# EAGLE schematic servo_controller (EAGLE 6.4)
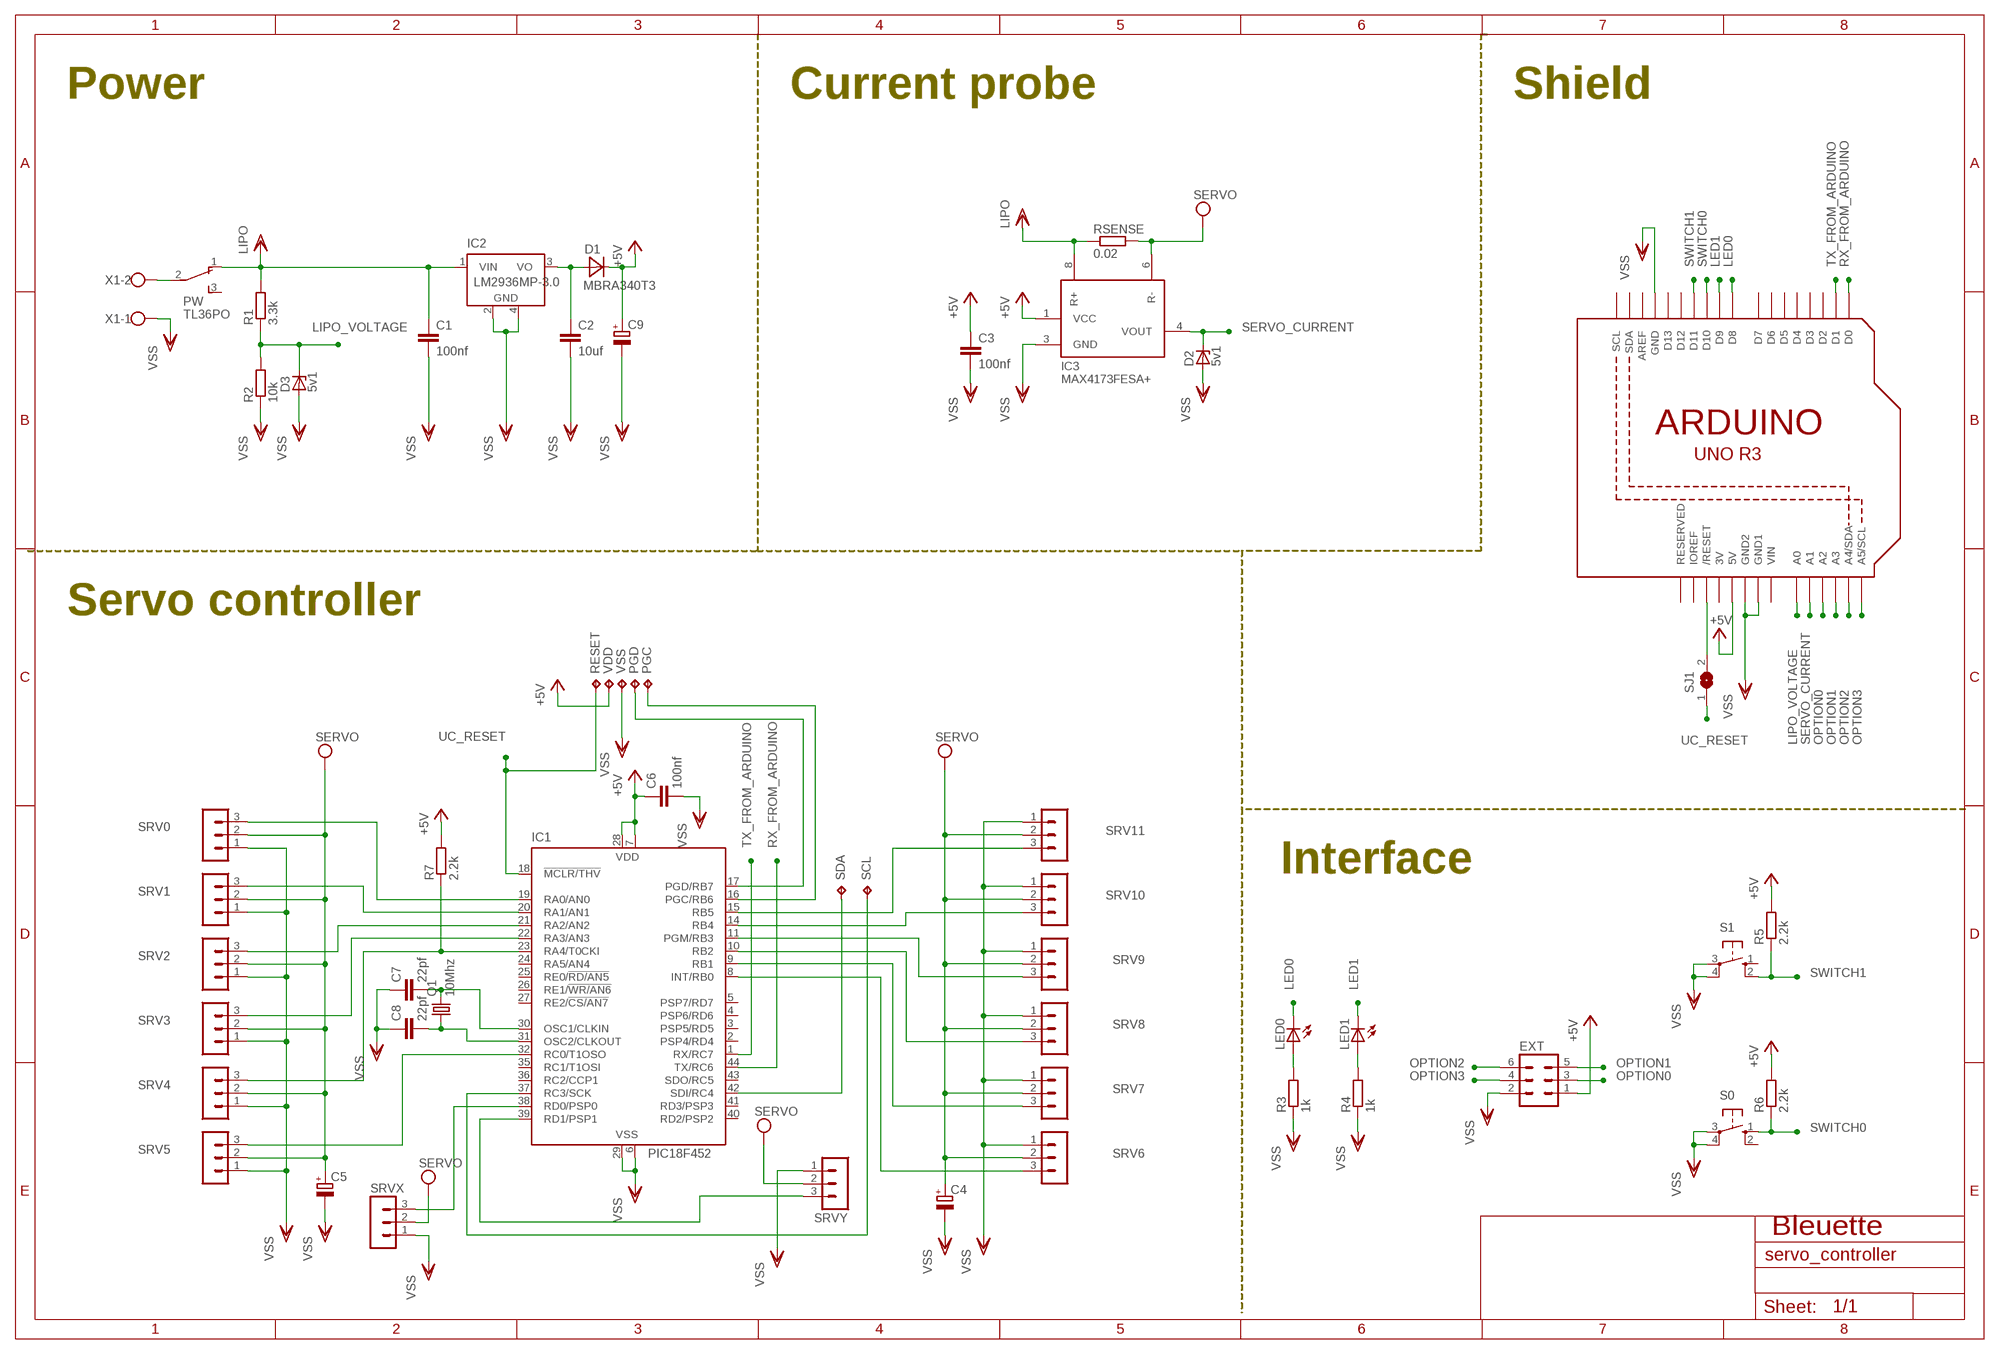
[diagram p0: schematic, sheet 1]

## Parts
C1  100nf  C-EUC1206  [C1206]
C2  10uf  C-EUC1206  [C1206]
C3  100nf  C-EUC1206  [C1206]
C4  CPOL-EUD  [PANASONIC_D]
C5  CPOL-EUD  [PANASONIC_D]
C6  100nf  C-EUC1206  [C1206]
C7  22pf  C-EUC1206  [C1206]
C8  22pf  C-EUC1206  [C1206]
C9  CPOL-EUF  [PANASONIC_F]
D1  MBRA340T3  [SMA]
D2  5v1  ZENER-DIODESOT23  [SOT23]
D3  5v1  ZENER-DIODESOT23  [SOT23]
EXT  MA03-2  [MA03-2]
IC1  PIC18F452  PIC16F877PT  [TQFP44]
IC2  LM2936MP-3.0  [SOT223]
IC3  MAX4173FESA+  MAX4173A  [SO08]
LED0  LEDCHIPLED_0805  [CHIPLED_0805]
LED1  LEDCHIPLED_0805  [CHIPLED_0805]
PGC  TPTP20R  [TP20R]
PGD  TPTP20R  [TP20R]
PW  TL36PO  [TL3XPO]
Q1  10Mhz  CRYTALHC49UP  [HC49UP]
R1  3.3k  R-EU_M1206  [M1206]
R2  10k  R-EU_M1206  [M1206]
R3  1k  R-EU_M0805  [M0805]
R4  1k  R-EU_M0805  [M0805]
R5  2.2k  R-EU_M0805  [M0805]
R6  2.2k  R-EU_M0805  [M0805]
R7  2.2k  R-EU_M0805  [M0805]
RESET  TPTP20R  [TP20R]
RSENSE  0.02  R-EU_R4527  [R4527]
S0  10-XX  [B3F-10XX]
S1  10-XX  [B3F-10XX]
SCL  TPTP20R  [TP20R]
SDA  TPTP20R  [TP20R]
SJ1  SJ  [SJ]
SRV0  MA03-1  [MA03-1]
SRV1  MA03-1  [MA03-1]
SRV2  MA03-1  [MA03-1]
SRV3  MA03-1  [MA03-1]
SRV4  MA03-1  [MA03-1]
SRV5  MA03-1  [MA03-1]
SRV6  MA03-1  [MA03-1]
SRV7  MA03-1  [MA03-1]
SRV8  MA03-1  [MA03-1]
SRV9  MA03-1  [MA03-1]
SRV10  MA03-1  [MA03-1]
SRV11  MA03-1  [MA03-1]
SRVX  MA03-1  [MA03-1]
SRVY  MA03-1  [MA03-1]
U1  ARDUINOR3-DIMENSION  [ARDUINOR3]
VDD  TPTP20R  [TP20R]
VSS  TPTP20R  [TP20R]
X1  W237-102  [W237-102]

## Nets
+5V: C3.1 C6.1 C9.+ D1.C EXT.1 IC1.7(VDD) IC1.28(VDD) IC3.1(VCC) R5.2 R6.2 R7.2 U1.5V VDD.TP
LED0: LED0.C U1.D8
LED1: LED1.C U1.D9
LIPO_VOLTAGE: D3.3(C) R1.1 R2.2 U1.A0
N$1: IC1.19(RA0/AN0) SRV0.3
N$2: IC1.20(RA1/AN1) SRV1.3
N$3: IC1.21(RA2/AN2) SRV2.3
N$4: IC1.22(RA3/AN3) SRV3.3
N$5: IC1.23(RA4/T0CKI) R7.1 SRV4.3
N$6: IC1.32(RC0/T1OSO) SRV5.3
N$7: LED0.A R3.2
N$8: LED1.A R4.2
N$9: IC1.42(SDI/RC4) SDA.TP
N$10: IC1.8(INT/RB0) SRV6.3
N$11: IC1.9(RB1) SRV7.3
N$12: IC1.10(RB2) SRV8.3
N$13: IC1.11(PGM/RB3) SRV9.3
N$14: IC1.14(RB4) SRV10.3
N$15: PW.2(P) X1.2
N$16: SJ1.2 U1.RESET(/RESET)
N$18: IC1.37(RC3/SCK) SCL.TP
N$19: IC1.38(RD0/PSP0) SRVX.3
N$20: C2.1 D1.A IC2.3(VO)
N$22: IC1.17(PGD/RB7) PGD.TP
N$23: IC1.16(PGC/RB6) PGC.TP
N$24: IC1.39(RD1/PSP1) SRVY.3
N$25: C8.2 IC1.31(OSC2/CLKOUT) Q1.1
N$27: C7.2 IC1.30(OSC1/CLKIN) Q1.2
N$32: IC1.15(RB5) SRV11.3
OPTION0: EXT.3 U1.A2
OPTION1: EXT.5 U1.A3
OPTION2: EXT.6 U1.A4(A4/SDA)
OPTION3: EXT.4 U1.A5(A5/SCL)
RX_FROM_ARDUINO: IC1.44(TX/RC6) U1.D0
SERVO_CURRENT: D2.3(C) IC3.4(VOUT) U1.A1
SWITCH0: R6.1 S0.1(S) U1.D10
SWITCH1: R5.1 S1.2(S1) U1.D11
TX_FROM_ARDUINO: IC1.1(RX/RC7) U1.D1
UC_RESET: IC1.18(!MCLR/THV) RESET.TP SJ1.1
VDD: C1.1 IC2.1(VIN) IC3.8(R+) PW.1(O) R1.2 RSENSE.1 ; supply symbol labelled LIPO
VEE: C4.+ C5.+ IC3.6(R-) RSENSE.2 SRV0.2 SRV1.2 SRV2.2 SRV3.2 SRV4.2 SRV5.2 SRV6.2 SRV7.2 SRV8.2 SRV9.2 SRV10.2 SRV11.2 SRVX.2 SRVY.2 ; supply symbol labelled SERVO
VSS: C1.2 C2.2 C3.2 C4.- C5.- C6.2 C7.1 C8.1 C9.- D2.1(A) D3.1(A) EXT.2 IC1.6(VSS) IC1.29(VSS) IC2.2(GND) IC2.4(GND) IC3.3(GND) R2.1 R3.1 R4.1 S0.3(P) S0.4(P1) S1.3(P) S1.4(P1) SRV0.1 SRV1.1 SRV2.1 SRV3.1 SRV4.1 SRV5.1 SRV6.1 SRV7.1 SRV8.1 SRV9.1 SRV10.1 SRV11.1 SRVX.1 SRVY.1 U1.GND U1.GND1 U1.GND2 VSS.TP X1.1
Unconnected: IC1.2(PSP4/RD4) IC1.3(PSP5/RD5) IC1.4(PSP6/RD6) IC1.5(PSP7/RD7) IC1.24(RA5/AN4) IC1.25(RE0/!RD/AN5) IC1.26(RE1/!WR/AN6) IC1.27(RE2/!CS/AN7) IC1.35(RC1/T1OSI) IC1.36(RC2/CCP1) IC1.40(RD2/PSP2) IC1.41(RD3/PSP3) IC1.43(SDO/RC5) PW.3(S) S0.2(S1) S1.1(S) U1.AREF U1.D2 U1.D3 U1.D4 U1.D5 U1.D6 U1.D7 U1.D12 U1.D13 U1.IOREF U1.RESERVED U1.SCL U1.SDA

## Notes on the sheet
- Power | Current probe | Shield
- Servo controller
- Interface
- Bleuette

## Power pins joined to a net without a drawn wire
3V: U1.3V
VIN: U1.VIN

## Library data of the parts
C1-C3 C6-C8 = rcl:C-EU: CAPACITOR, European symbol
C4 C5 C9 = rcl:CPOL-EU: POLARIZED CAPACITOR, European symbol
D1 = diode:MBRA340T3: Surface Mount Schottky Power Rectifier Source: http://www.onsemi.com/pub_link/Collateral/MBRA340T3-D.PDF
D2 D3 = diode:ZENER-DIODE: Z-Diode
EXT = con-lstb:MA03-2: PIN HEADER; OC_FARNELL: unknown; OC_NEWARK: unknown
IC1 = microchip:PIC16F87*: MICROCONTROLLER; MF: MICROCHIP; MPN: PIC16F877-04/PQ; OC_FARNELL: 9761411; OC_NEWARK: 23C5094
IC2 = national-semiconductor:LM2936MP?*: Ultra-Low Quiescent Current LDO Voltage Regulator Source: Data sheet <http://www.national.com/ds/LM/LM2936.pdf>; MF: NATIONAL SEMICONDUCTOR; MPN: LM2936MP-3.0/NOPB; OC_FARNELL: 1496125; OC_NEWARK: 41K4522
IC3 = AWJLEagleLib:MAX4173: Maxim MAX4173 high side current monitor SOT363 pin 2 goes to GND
LED0 LED1 = led:LED: LED OSRAM: - CHIPLED LG R971, LG N971, LY N971, LG Q971, LY Q971, LO R971, LY R971 LH N974, LH R974 LS Q976, LO Q976, LY Q976 LO Q996 - Hyper CHIPLED LW Q18S LB Q993, LB Q99A, LB R99A - SideLED LS A670, LO A670, LY A670, LG A670, LP A670 LB A673, LV A673, LT A673, LW A673 LH A674 LY A675 LS A676, LA A676, LO A676, LY A676, LW A676 LS A679, LY A679, LG A679 - Hyper Micro SIDELED® LS Y876, LA Y876, LO Y876, LY Y876 LT Y87S - SmartLED LW L88C, LW L88S LB L89C, LB L89S, LG L890 LS L89K, LO L89K, LY L89K LS L896, LA L896, LO L896, LY L896 - TOPLED LS T670, LO T670, LY T670, LG T670, LP T670 LSG T670, LSP T670, LSY T670, LOP T670, LYG T670 LG T671, LOG T671, LSG T671 LB T673, LV T673, LT T673, LW T673 LH T674 LS T676, LA T676, LO T676, LY T676, LB T676, LH T676, LSB T676, LW T676 LB T67C, LV T67C, LT T67C, LS T67K, LO T67K, LY T67K, LW E67C LS E67B, LA E67B, LO E67B, LY E67B, LB E67C, LV E67C, LT E67C LW T67C LS T679, LY T679, LG T679 LS T770, LO T770, LY T770, LG T770, LP T770 LB T773, LV T773, LT T773, LW T773 LH T774 LS E675, LA E675, LY E675, LS T675 LS T776, LA T776, LO T776, LY T776, LB T776 LHGB T686 LT T68C, LB T68C - Hyper Mini TOPLED® LB M676 - Mini TOPLED Santana® LG M470 LS M47K, LO M47K, LY M47K Source: http://www.osram.convergy.de LUXEON: - LUMILED® LXK2-PW12-R00, LXK2-PW12-S00, LXK2-PW14-U00, LXK2-PW14-V00 LXK2-PM12-R00, LXK2-PM12-S00, LXK2-PM14-U00 LXK2-PE12-Q00, LXK2-PE12-R00, LXK2-PE12-S00, LXK2-PE14-T00, LXK2-PE14-U00 LXK2-PB12-K00, LXK2-PB12-L00, LXK2-PB12-M00, LXK2-PB14-N00, LXK2-PB14-P00, LXK2-PB14-Q00 LXK2-PR12-L00, LXK2-PR12-M00, LXK2-PR14-Q00, LXK2-PR14-R00 LXK2-PD12-Q00, LXK2-PD12-R00, LXK2-PD12-S00 LXK2-PH12-R00, LXK2-PH12-S00 LXK2-PL12-P00, LXK2-PL12-Q00, LXK2-PL12-R00 Source: www.luxeon.com KINGBRIGHT: KA-3528ASYC Source: www.kingbright.com
PGC PGD RESET SCL SDA VDD VSS = testpad:TP: Test pad
PW = switch:TL36PO: TINY SWITCH ON - ON Source: http://www2.produktinfo.conrad.com/datenblaetter/700000-724999/705152-da-01-de-Subminiaturschalter_TL_36YO.pdf
Q1 = crystal:CRYTAL: CRYSTAL
R1-R7 RSENSE = rcl:R-EU_: RESISTOR, European symbol
S0 S1 = switch-omron:10-XX: OMRON SWITCH; MPN: B3F-1000; OC_FARNELL: 176432; OC_NEWARK: 36M3542
SJ1 = jumper:SJ: SMD solder JUMPER
SRV0 SRV1-SRV11 SRVX SRVY = con-lstb:MA03-1: PIN HEADER
U1 = adafruit:ARDUINOR3: This is a new object for the new Arduino R3 - with extra pins that you may want to use (such as IOref, and duplicated A4/A5
X1 = con-wago-500:W237-102: WAGO SCREW CLAMP; MPN: 237-102; OC_FARNELL: unknown; OC_NEWARK: 70K9898